# Altium schematic sheet Sheet1.SchDoc
size A; SheetNumber: 1; SheetTotal: 1
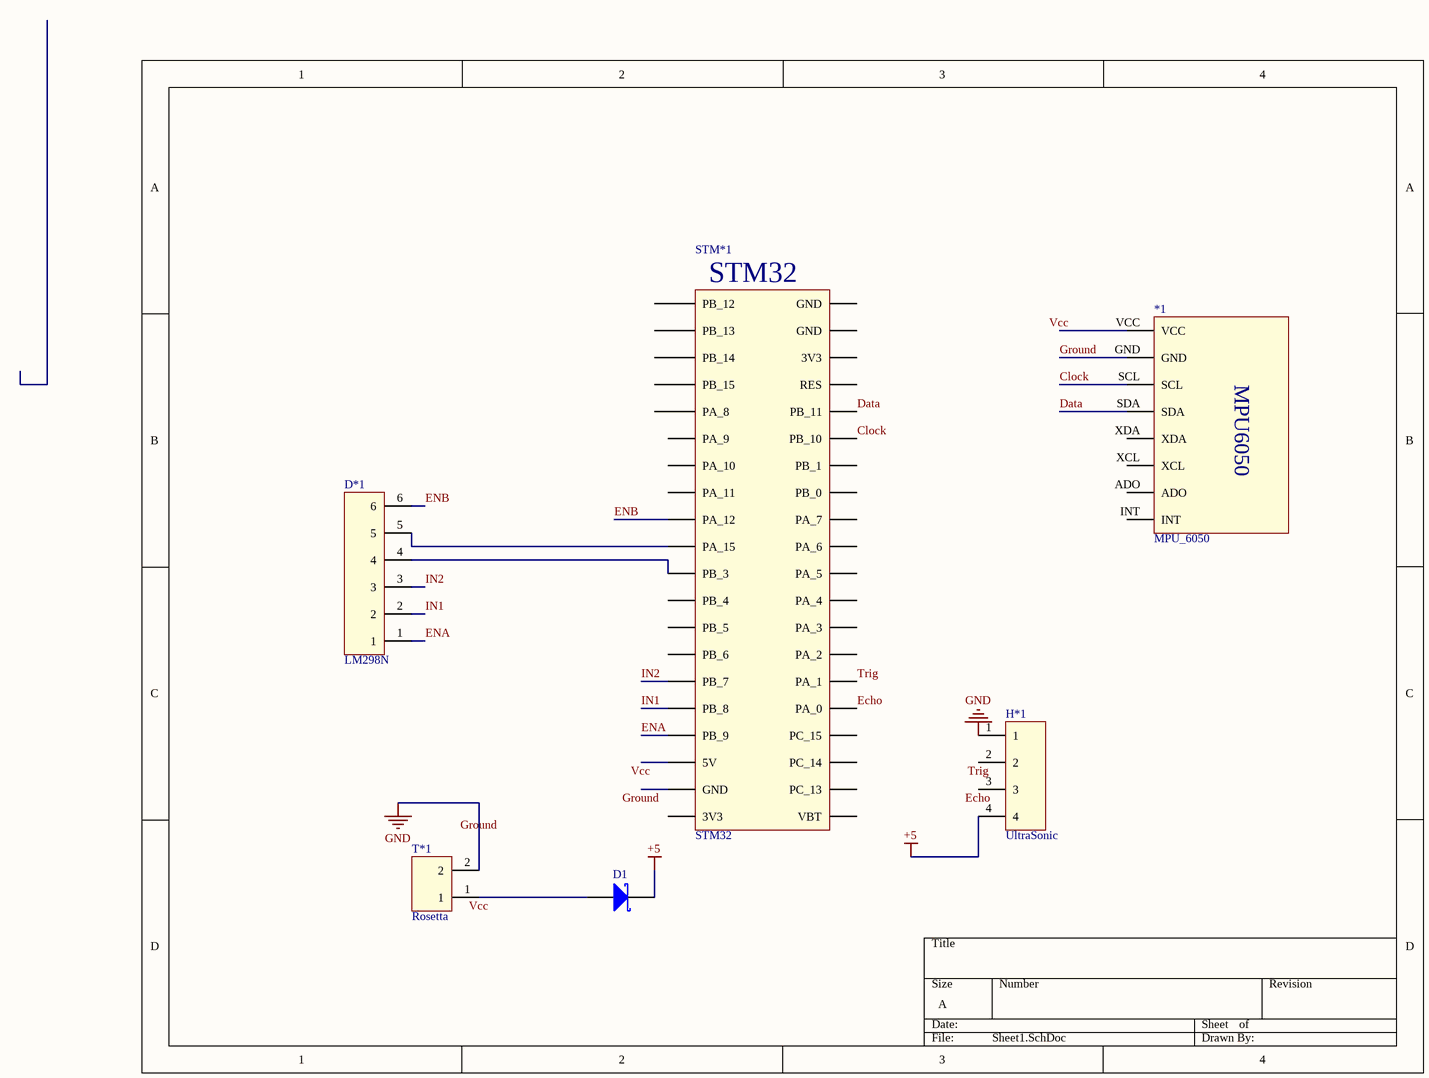
[diagram p0: Sheet1.SchDoc]

## Parts
*1  MPU_6050  [MPU6050]
D1  Schottky Diode  (value not drawn)
D*1  LM298N  [DATA_PIN_HEADER_6_2.54m]
H*1  UltraSonic  [Female_Header_4]
STM*1  STM32  [STM32]
T*1  Rosetta  [Terminal_block_2pins_3.5mm]

## Nets
+5: D1.2(K) H*1.4
Ground: *1.GND H*1.1 STM*1.GND T*1.2  [also labelled GND]
Clock: *1.SCL STM*1.PB_10
Data: *1.SDA STM*1.PB_11
Echo: H*1.3 STM*1.PA_0
ENA: D*1.1 STM*1.PB_9
ENB: D*1.6 STM*1.PA_12
IN1: D*1.2 STM*1.PB_8
IN2: D*1.3 STM*1.PB_7
Trig: H*1.2 STM*1.PA_1
Vcc: *1.VCC D1.1(A) STM*1.5V T*1.1
NetD*1_4: D*1.4 STM*1.PB_3
NetD*1_5: D*1.5 STM*1.PA_15

Not connected (* = marked no-connect by the designer): *1 ADO INT XCL XDA; STM*1 3V3 PA_2 PA_3 PA_4 PA_5 PA_6 PA_7 PA_8 PA_9 PA_10 PA_11 PB_0 PB_1 PB_4 PB_5 PB_6 PB_12 PB_13 PB_14 PB_15 PC_13 PC_14 PC_15 RES VBT

## Notes on the sheet
- (in symbol MPU_6050) MPU6050

## Library data of the parts
D1 = Schottky Diode: AF: 1; BV: 0; BV_MAX: 1e99; EG: 1.11; FC: 0.5; IBV: 0.001; IS: 1e-14; MJSW: 0.33; NTUN: 30; TNOM: 27; XTI: 3; SimulationGenericComponent: True; CJO: 0; CJP: 0; CTA: 0; CTP: 0; FCS: 0.5; FV_MAX: 1e99; IKF: 0; IKR: 0; ISR: 1e-14; JSW: 0; JTUN: 0; JTUNSW: 0; KEG: 1; KF: 0; LEVEL: 1; N: 1; NBV: 1; NR: 1; NS: 1; PHP: 1; RS: 0; TCV: 0; TLEV: 0; TLEVC: 0; TM1: 0; TM2: 0; TPB: 0; TPHP: 0; TRS: 0; TRS2: 0; TT: 0; TTT1: 0; TTT2: 0; VJ: 1; XTITUN: 3
D*1 = DATA_PIN_HEADER_6_2.54m
H*1 = FEMALE_HEADER_4
T*1 = Terminal_block_2pins_3.5mm